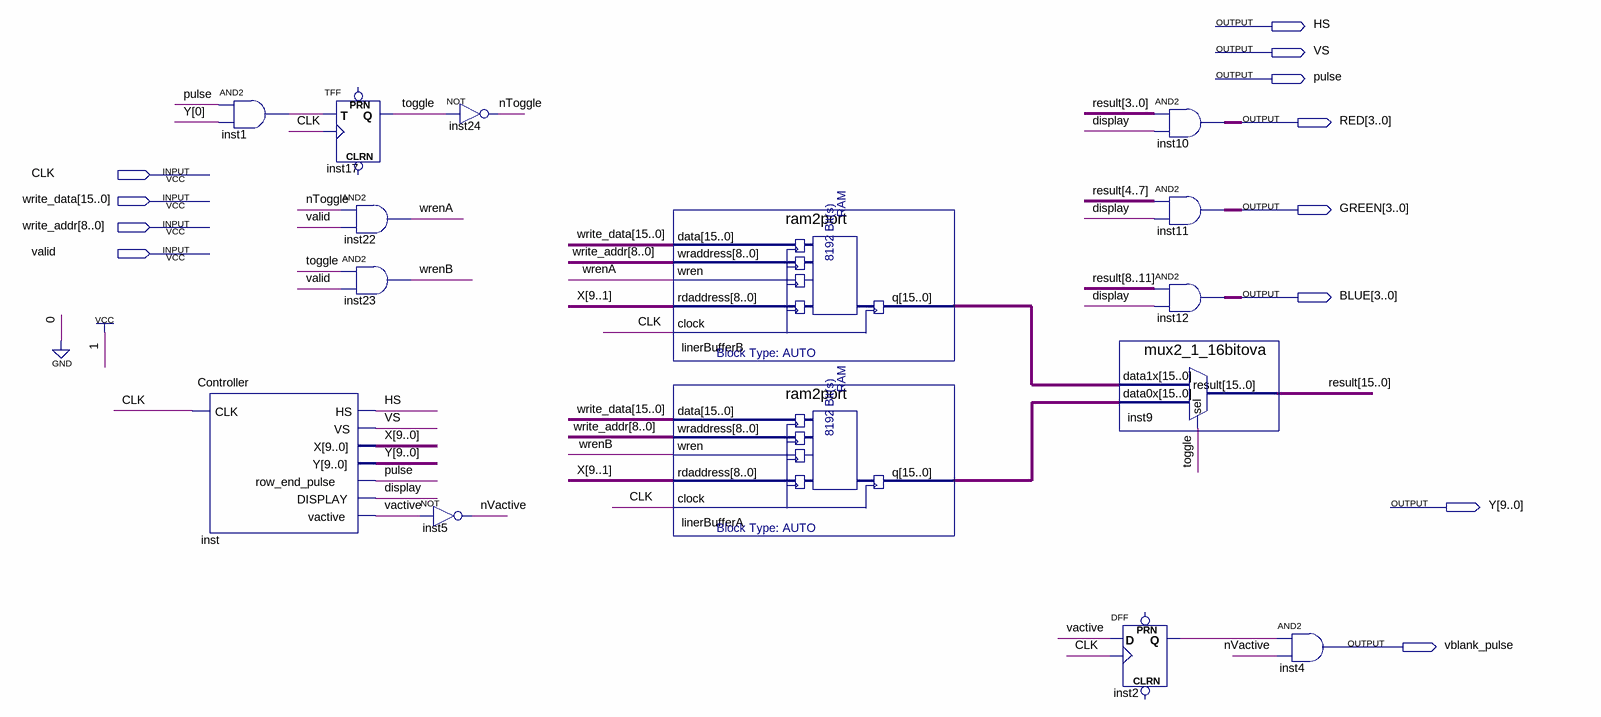
[diagram p0: schematic sheet]
// Quartus schematic Monitor.bdf as structural Verilog: 15 symbols, 12 pins
module Monitor (
  input  CLK,
  input  [15:0] write_data,
  input  [8:0] write_addr,
  input  valid,
  output HS,
  output VS,
  output pulse,
  output [3:0] RED,
  output [3:0] GREEN,
  output [3:0] BLUE,
  output [9:0] Y,
  output vblank_pulse
);

  wire display, inst1_out, inst2_q, nToggle, nVactive, toggle, vactive, wrenA, wrenB;
  wire [9:0] X;
  wire [15:0] linerBufferA_q, linerBufferB_q, result;

  and inst1 (inst1_out, pulse, Y[0]);
  Controller inst (
    .CLK(CLK), .HS(HS), .VS(VS), .X(X), .Y(Y), .row_end_pulse(pulse), .DISPLAY(display), .vactive(vactive));
  TFF inst17 (.T(inst1_out), .CLK(CLK), .Q(toggle));  // open: PRN, CLRN
  and inst22 (wrenA, nToggle, valid);
  and inst23 (wrenB, toggle, valid);
  not inst5 (nVactive, vactive);
  not inst24 (nToggle, toggle);
  ram2port linerBufferB (
    .data(write_data), .wraddress(write_addr), .wren(wrenA), .rdaddress(X[9:1]), .clock(CLK),
    .q(linerBufferB_q));
  ram2port linerBufferA (
    .data(write_data), .wraddress(write_addr), .wren(wrenB), .rdaddress(X[9:1]), .clock(CLK),
    .q(linerBufferA_q));
  mux2_1_16bitova inst9 (.data1x(linerBufferB_q), .data0x(linerBufferA_q), .sel(toggle), .result(result));
  DFF inst2 (.CLK(CLK), .D(vactive), .Q(inst2_q));  // open: CLRN, PRN
  assign RED = result[3:0] & {4{display}};  // AND2 inst10, 4 bits wide
  assign GREEN = {result[4], result[5], result[6], result[7]} & {4{display}};  // AND2 inst11, 4 bits wide
  assign BLUE = {result[8], result[9], result[10], result[11]} & {4{display}};  // AND2 inst12, 4 bits wide
  and inst4 (vblank_pulse, inst2_q, nVactive);
endmodule
